# Altium schematic sheet CONNECTOR.SchDoc
size 420 x 297 mm; SheetNumber: 2; SheetTotal: 4
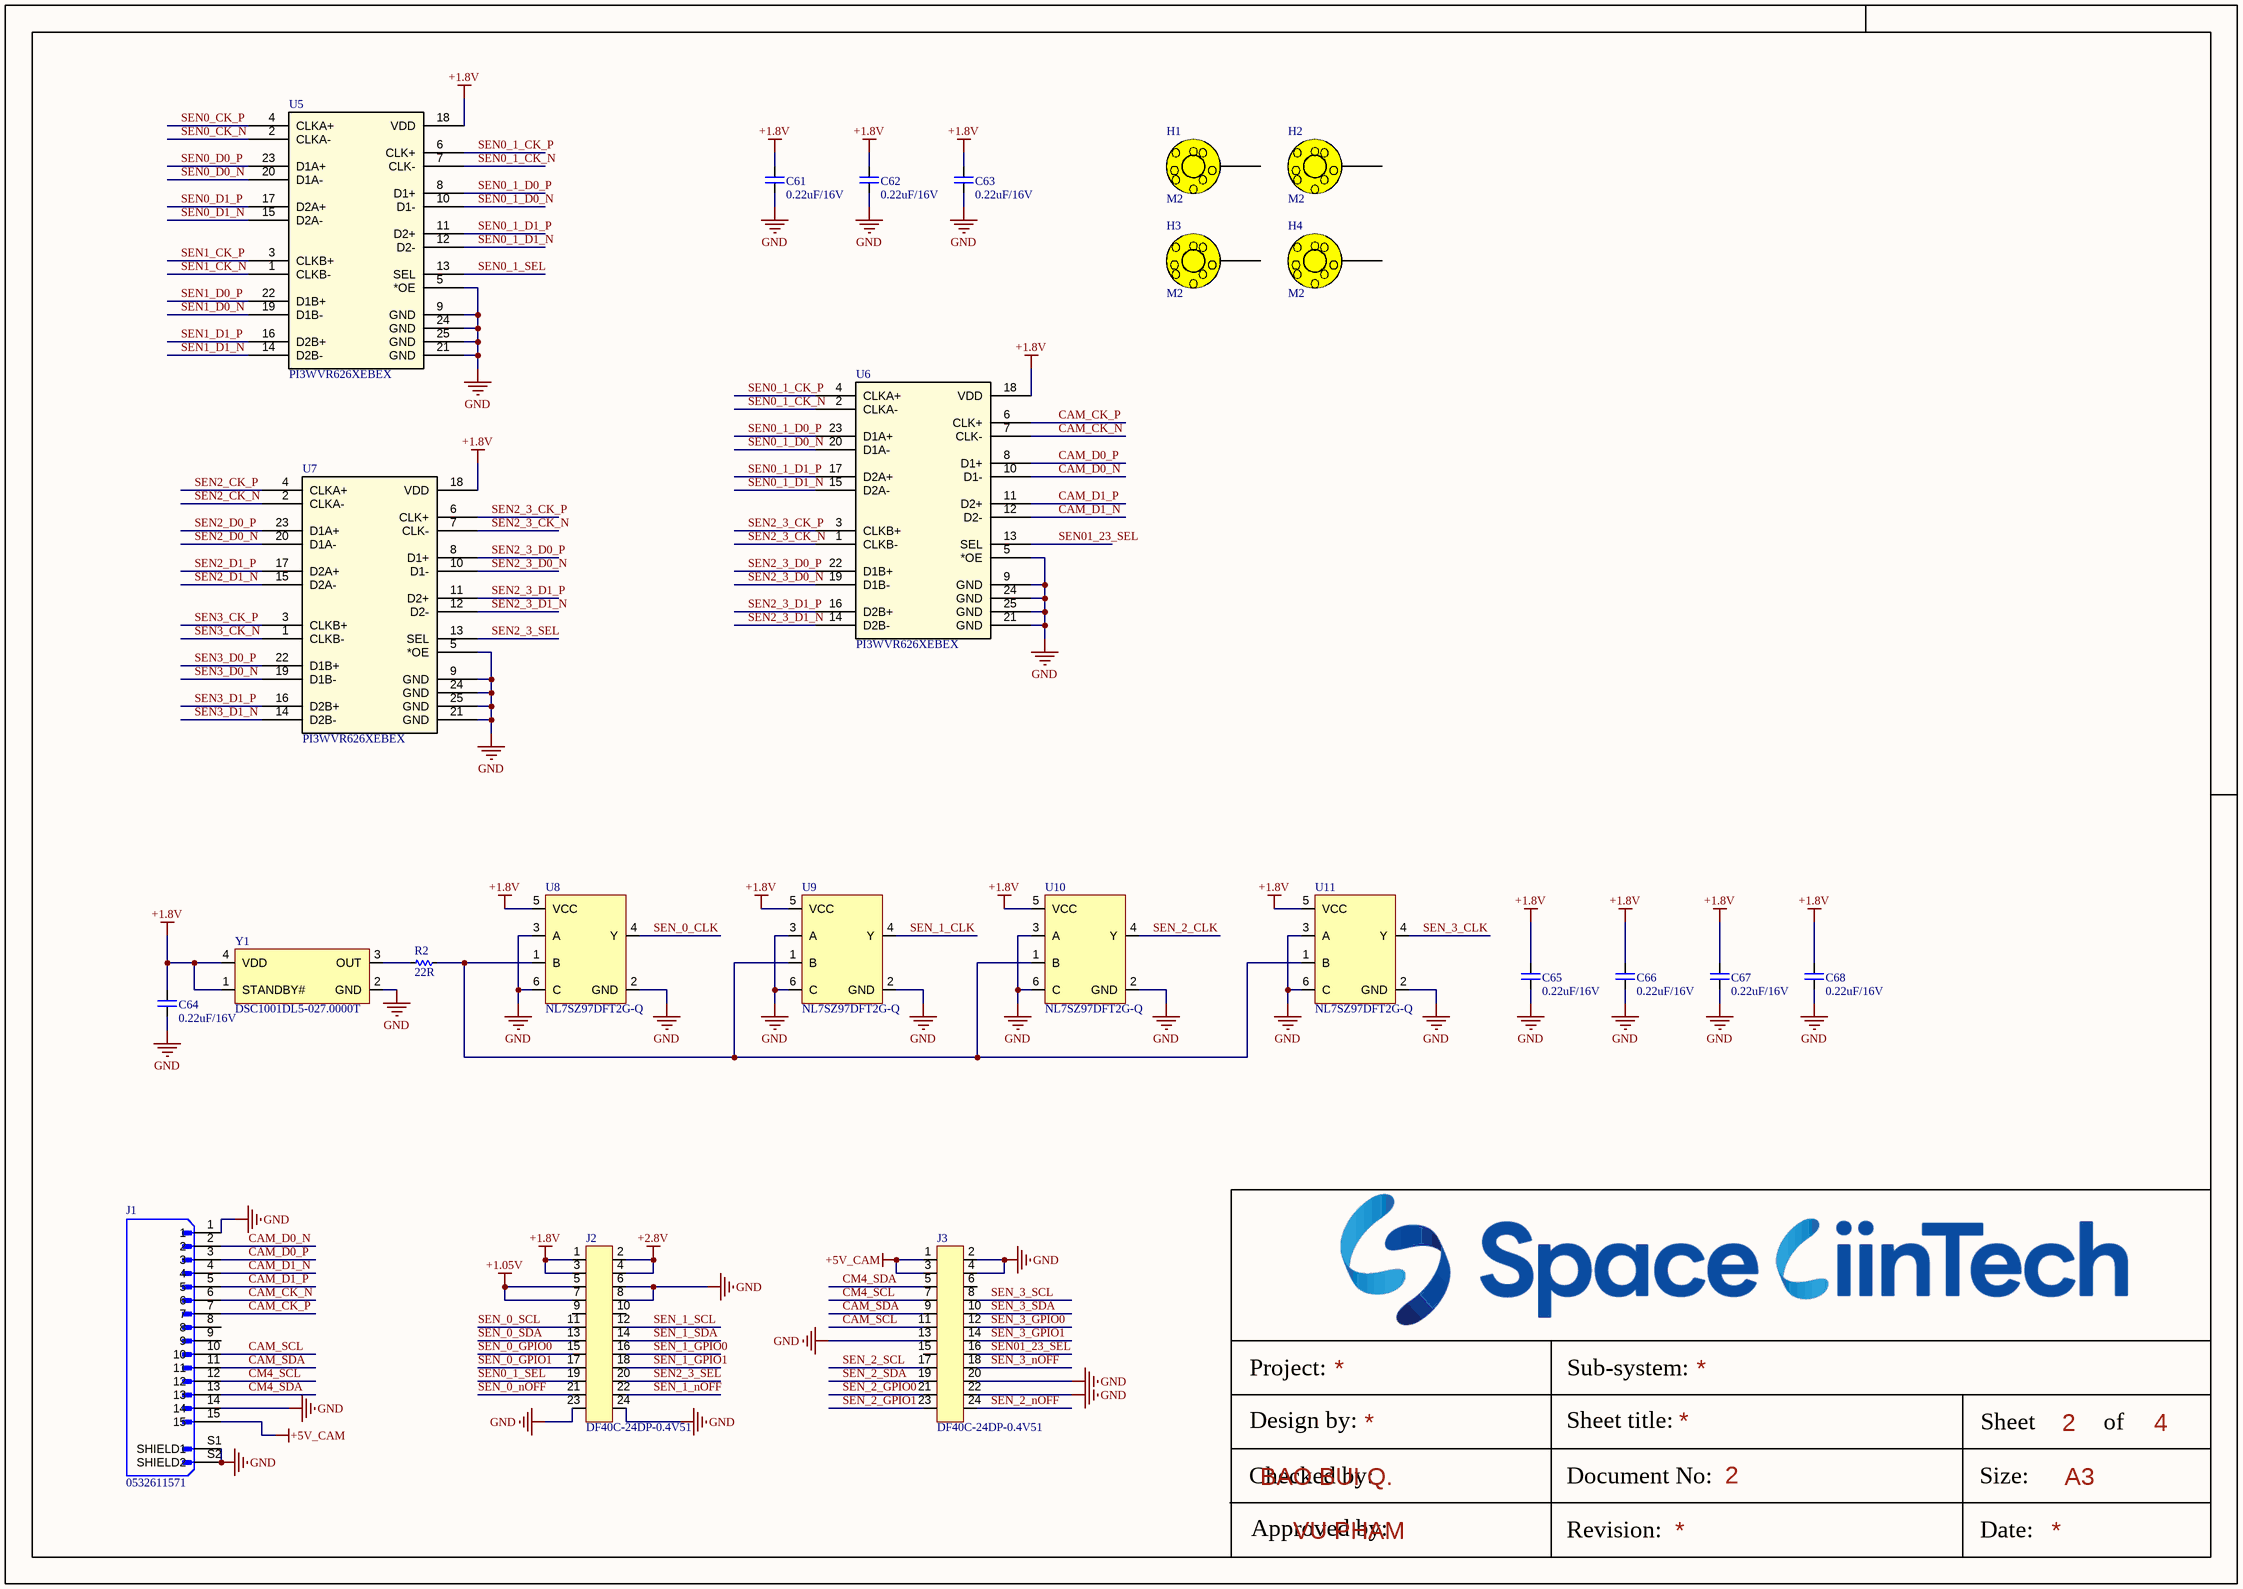
[diagram p0: CONNECTOR.SchDoc]

## Parts
C61  0.22uF/16V  [CAP_C_1005X60]
C62  0.22uF/16V  [CAP_C_1005X60]
C63  0.22uF/16V  [CAP_C_1005X60]
C64  0.22uF/16V  [CAP_C_1005X60]
C65  0.22uF/16V  [CAP_C_1005X60]
C66  0.22uF/16V  [CAP_C_1005X60]
C67  0.22uF/16V  [CAP_C_1005X60]
C68  0.22uF/16V  [CAP_C_1005X60]
H1  M2  [HEX-2.2mm]
H2  M2  [HEX-2.2mm]
H3  M2  [HEX-2.2mm]
H4  M2  [HEX-2.2mm]
J1  0532611571  [0532611571]
J2  DF40C-24DP-0.4V51  [CONN24_6p32X1p85]
J3  DF40C-24DP-0.4V51  [CONN24_6p32X1p85]
R2  22R  [RES_C_1005X40]
U5  PI3WVR626XEBEX  [PI3WVR626XEBEX_DIO]
U6  PI3WVR626XEBEX  [PI3WVR626XEBEX_DIO]
U7  PI3WVR626XEBEX  [PI3WVR626XEBEX_DIO]
U8  NL7SZ97DFT2G-Q  [SC-88]
U9  NL7SZ97DFT2G-Q  [SC-88]
U10  NL7SZ97DFT2G-Q  [SC-88]
U11  NL7SZ97DFT2G-Q  [SC-88]
Y1  DSC1001DL5-027.0000T  [OSCDFN250X200X89-4N]

## Nets
+1.05V: J2.5 J2.7
+1.8V: C61.2 C62.2 C63.2 C64.2 C65.2 C66.2 C67.2 C68.2 J2.1 J2.3 U5.18(VDD) U6.18(VDD) U7.18(VDD) U8.5(VCC) U9.5(VCC) U10.5(VCC) U11.5(VCC) Y1.1(STANDBY#) Y1.4(VDD)
+2.8V: J2.2 J2.4
+5V_CAM: J1.15 J3.1 J3.3
GND: C61.1 C62.1 C63.1 C64.1 C65.1 C66.1 C67.1 C68.1 J1.1 J1.14 J1.S1(SHIELD1) J1.S2(SHIELD2) J2.6 J2.8 J2.23 J2.24 J3.2 J3.4 J3.13 J3.20 J3.22 U5.5(*OE) U5.9(GND) U5.21(GND) U5.24(GND) U5.25(GND) U6.5(*OE) U6.9(GND) U6.21(GND) U6.24(GND) U6.25(GND) U7.5(*OE) U7.9(GND) U7.21(GND) U7.24(GND) U7.25(GND) U8.2(GND) U8.3(A) U8.6(C) U9.2(GND) U9.3(A) U9.6(C) U10.2(GND) U10.3(A) U10.6(C) U11.2(GND) U11.3(A) U11.6(C) Y1.2(GND)
CAM_CK_N: J1.6 U6.7(CLK-)
CAM_CK_P: J1.7 U6.6(CLK+)
CAM_D0_N: J1.2 U6.10(D1-)
CAM_D0_P: J1.3 U6.8(D1+)
CAM_D1_N: J1.4 U6.12(D2-)
CAM_D1_P: J1.5 U6.11(D2+)
CAM_SCL: J1.10 J3.11
CAM_SDA: J1.11 J3.9
CM4_SCL: J1.12 J3.7
CM4_SDA: J1.13 J3.5
SEN0_1_CK_N: U5.7(CLK-) U6.2(CLKA-)
SEN0_1_CK_P: U5.6(CLK+) U6.4(CLKA+)
SEN0_1_D0_N: U5.10(D1-) U6.20(D1A-)
SEN0_1_D0_P: U5.8(D1+) U6.23(D1A+)
SEN0_1_D1_N: U5.12(D2-) U6.15(D2A-)
SEN0_1_D1_P: U5.11(D2+) U6.17(D2A+)
SEN0_1_SEL: J2.19 U5.13(SEL)
SEN0_CK_N: U5.2(CLKA-)
SEN0_CK_P: U5.4(CLKA+)
SEN0_D0_N: U5.20(D1A-)
SEN0_D0_P: U5.23(D1A+)
SEN0_D1_N: U5.15(D2A-)
SEN0_D1_P: U5.17(D2A+)
SEN01_23_SEL: J3.16 U6.13(SEL)
SEN1_CK_N: U5.1(CLKB-)
SEN1_CK_P: U5.3(CLKB+)
SEN1_D0_N: U5.19(D1B-)
SEN1_D0_P: U5.22(D1B+)
SEN1_D1_N: U5.14(D2B-)
SEN1_D1_P: U5.16(D2B+)
SEN2_3_CK_N: U6.1(CLKB-) U7.7(CLK-)
SEN2_3_CK_P: U6.3(CLKB+) U7.6(CLK+)
SEN2_3_D0_N: U6.19(D1B-) U7.10(D1-)
SEN2_3_D0_P: U6.22(D1B+) U7.8(D1+)
SEN2_3_D1_N: U6.14(D2B-) U7.12(D2-)
SEN2_3_D1_P: U6.16(D2B+) U7.11(D2+)
SEN2_3_SEL: J2.20 U7.13(SEL)
SEN2_CK_N: U7.2(CLKA-)
SEN2_CK_P: U7.4(CLKA+)
SEN2_D0_N: U7.20(D1A-)
SEN2_D0_P: U7.23(D1A+)
SEN2_D1_N: U7.15(D2A-)
SEN2_D1_P: U7.17(D2A+)
SEN3_CK_N: U7.1(CLKB-)
SEN3_CK_P: U7.3(CLKB+)
SEN3_D0_N: U7.19(D1B-)
SEN3_D0_P: U7.22(D1B+)
SEN3_D1_N: U7.14(D2B-)
SEN3_D1_P: U7.16(D2B+)
SEN_0_CLK: U8.4(Y)
SEN_0_GPIO0: J2.15
SEN_0_GPIO1: J2.17
SEN_0_nOFF: J2.21
SEN_0_SCL: J2.11
SEN_0_SDA: J2.13
SEN_1_CLK: U9.4(Y)
SEN_1_GPIO0: J2.16
SEN_1_GPIO1: J2.18
SEN_1_nOFF: J2.22
SEN_1_SCL: J2.12
SEN_1_SDA: J2.14
SEN_2_CLK: U10.4(Y)
SEN_2_GPIO0: J3.21
SEN_2_GPIO1: J3.23
SEN_2_nOFF: J3.24
SEN_2_SCL: J3.17
SEN_2_SDA: J3.19
SEN_3_CLK: U11.4(Y)
SEN_3_GPIO0: J3.12
SEN_3_GPIO1: J3.14
SEN_3_nOFF: J3.18
SEN_3_SCL: J3.8
SEN_3_SDA: J3.10
NetR2_1: R2.1 U8.1(B) U9.1(B) U10.1(B) U11.1(B)
NetR2_2: R2.2 Y1.3(OUT)

Not connected (* = marked no-connect by the designer): H1 1; H2 1; H3 1; H4 1; J1 8 9; J2 9 10; J3 6 15

## Notes on the sheet
- Project:
- Sub-system:
- Design by:
- BAO BUI Q.
- Sheet title:
- Sheet
- A3
- of
- Checked by:
- Approved by:
- VU PHAM
- Revision:
- Document No:
- Size:
- Date:

## Library data of the parts
C61-C68 = CAP_SMD: CAP_Chip; Value: 33pF
H1-H4 = HEX-M3
J1 = CONN_SMD_15: Conn Shrouded Header (4 Sides) HDR 15 POS 1.25mm Solder RA Side Entry SMD PicoBladeâ„¢ T/R; MF: Molex; Package: None; MP: 532611571; Check_prices: https://www.snapeda.com/parts/532611571/Molex/view-part/?ref=eda; Purchase-URL: https://pricing.snapeda.com/search/part/532611571/?ref=eda; Value: *; Availability: In Stock; Price: None; SnapEDA_Link: https://www.snapeda.com/parts/532611571/Molex/view-part/?ref=snap
J2 J3 = DF40C-24DP-0.4V51: No Description Available; Mfr_Name: Hirose; RefDes: RefDes; Type: Type
R2 = RES-SMD: RES-Chip; Manufacturer: Generic Components; Class: Passive; Published: 08/06/2000; Publisher: Altium Hobart Technology Centre
U5-U7 = PI3WVR626XEBEX: Mfr_Name: Diodes Inc; RefDes: RefDes; Type: Type
U8-U11 = IC_FLEXLOGIC_NL7SZ97DFT2G-Q
Y1 = Y_OSC27MHz_DSC1001DL5-027.0000T